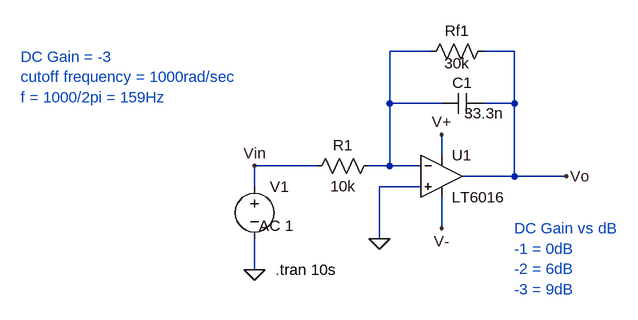
[diagram p0: schematic Task1_Filter_Design2.asc]
Task1_Filter_Design2.asc, the LTspice schematic file:
Version 4.1
SHEET 1 880 680
WIRE 256 -16 192 -16
WIRE 384 -16 336 -16
WIRE 192 64 192 -16
WIRE 272 64 192 64
WIRE 384 64 384 -16
WIRE 384 64 336 64
WIRE 272 144 272 112
WIRE 80 160 -16 160
WIRE 192 160 192 64
WIRE 192 160 160 160
WIRE 240 160 192 160
WIRE 384 176 384 64
WIRE 384 176 304 176
WIRE 464 176 384 176
WIRE -16 192 -16 160
WIRE 240 192 176 192
WIRE 272 256 272 208
WIRE 176 272 176 192
WIRE -16 320 -16 272
FLAG 176 272 0
FLAG 464 176 Vo
FLAG -16 320 0
FLAG -16 160 Vin
FLAG 272 112 V+
FLAG 272 256 V-
SYMBOL OpAmps\\LT6016 272 176 R0
SYMATTR InstName U1
SYMBOL res 176 144 R90
WINDOW 0 0 56 VBottom 2
WINDOW 3 32 56 VTop 2
SYMATTR InstName R1
SYMATTR Value 10k
SYMBOL res 352 -32 R90
WINDOW 0 0 56 VBottom 2
WINDOW 3 50 56 VBottom 2
SYMATTR InstName Rf1
SYMATTR Value 30k
SYMBOL cap 336 48 R90
WINDOW 0 0 32 VBottom 2
WINDOW 3 47 -1 VBottom 2
SYMATTR InstName C1
SYMATTR Value 33.3n
SYMBOL voltage -16 176 R0
WINDOW 123 7 76 Left 2
WINDOW 39 12 97 Left 2
SYMATTR InstName V1
SYMATTR Value ""
SYMATTR Value2 AC 1
TEXT 16 320 Left 2 !.tran 10s
TEXT -376 -8 Left 2 ;DC Gain = -3\ncutoff frequency = 1000rad/sec\nf = 1000/2pi = 159Hz
TEXT 384 256 Left 2 ;DC Gain vs dB\n-1 = 0dB\n-2 = 6dB\n-3 = 9dB

The netlist it stands for:
* Task1_Filter_Design2.asc
* U1: LT6016 (symbol OpAmps\LT6016 not available, pins judged from their places): In+=0 In-=N001 V+=V+ V-=V- OUT=Vo
R1 N001 Vin 10k
Rf1 Vo N001 30k
C1 Vo N001 33.3n
V1 Vin 0 AC 1
.tran 10s
* DC Gain = -3
* cutoff frequency = 1000rad/sec
* f = 1000/2pi = 159Hz
* DC Gain vs dB
* -1 = 0dB
* -2 = 6dB
* -3 = 9dB
.backanno
.end